# Altium schematic sheet HSS.SchDoc
size A3
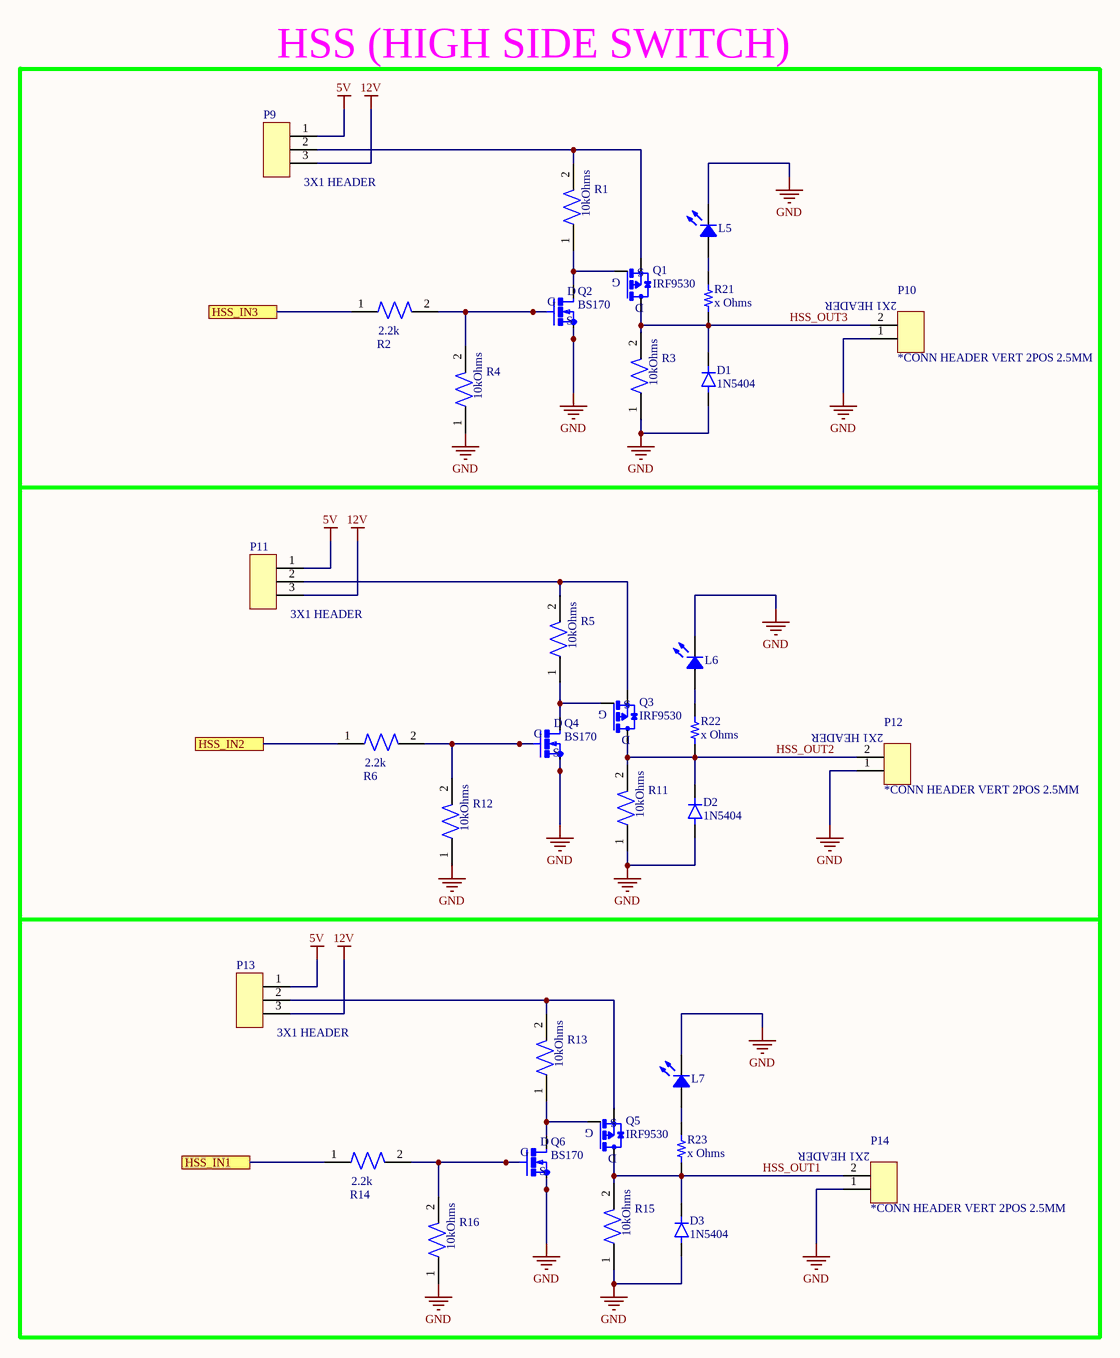
[diagram p0: HSS.SchDoc]

## Parts
D1  1N5404  [DIOAD1990W125L900D530]
D2  1N5404  [DIOAD1990W125L900D530]
D3  1N5404  [DIOAD1990W125L900D530]
L5  LED_SMD  [LED_SMD]  (value not drawn)
L6  LED_SMD  [LED_SMD]  (value not drawn)
L7  LED_SMD  [LED_SMD]  (value not drawn)
P9  CONN HEADER VERT 3POS 2.5MM  [2132230-3]  (value not drawn)
P10  *CONN HEADER VERT 2POS 2.5MM  [51025-02-0100-01]
P11  CONN HEADER VERT 3POS 2.5MM  [2132230-3]  (value not drawn)
P12  *CONN HEADER VERT 2POS 2.5MM  [51025-02-0100-01]
P13  CONN HEADER VERT 3POS 2.5MM  [2132230-3]  (value not drawn)
P14  *CONN HEADER VERT 2POS 2.5MM  [51025-02-0100-01]
Q1  IRF9530  [DPAK508P1524X483-3N]
Q2  BS170  [SOT91P240X120-3N]
Q3  IRF9530  [DPAK508P1524X483-3N]
Q4  BS170  [SOT91P240X120-3N]
Q5  IRF9530  [DPAK508P1524X483-3N]
Q6  BS170  [SOT91P240X120-3N]
R1  RES 10K OHM 1% 1/8W 0805  [RES 1206_3216 RF]  (value not drawn)
R2  RES 10K OHM 1% 1/8W 0805  [RES 0805_2012]  (value not drawn)
R3  RES 10K OHM 1% 1/8W 0805  [RES 1206_3216 RF]  (value not drawn)
R4  RES 10K OHM 1% 1/8W 0805  [RES 1206_3216 RF]  (value not drawn)
R5  RES 10K OHM 1% 1/8W 0805  [RES 1206_3216 RF]  (value not drawn)
R6  RES 10K OHM 1% 1/8W 0805  [RES 0805_2012]  (value not drawn)
R11  RES 10K OHM 1% 1/8W 0805  [RES 1206_3216 RF]  (value not drawn)
R12  RES 10K OHM 1% 1/8W 0805  [RES 1206_3216 RF]  (value not drawn)
R13  RES 10K OHM 1% 1/8W 0805  [RES 1206_3216 RF]  (value not drawn)
R14  RES 10K OHM 1% 1/8W 0805  [RES 0805_2012]  (value not drawn)
R15  RES 10K OHM 1% 1/8W 0805  [RES 1206_3216 RF]  (value not drawn)
R16  RES 10K OHM 1% 1/8W 0805  [RES 1206_3216 RF]  (value not drawn)
R21  x Ohms  [RES 1206_3216 RF]
R22  x Ohms  [RES 1206_3216 RF]
R23  x Ohms  [RES 1206_3216 RF]

## Blocks framed on the sheet
HSS (HIGH SIDE SWITCH): D1-D3 L5-L7 P9-P14 Q1-Q6 R1-R6 R11-R16 R21-R23

## Ports
HSS_IN1, HSS_IN2, HSS_IN3

## Nets
5V: P9.1 P11.1 P13.1
12V: P9.3 P11.3 P13.3
GND: D1.A D2.A D3.A L5.2 L6.2 L7.2 P10.1 P12.1 P14.1 Q2.S Q4.S Q6.S R3.1 R4.1 R11.1 R12.1 R15.1 R16.1
HSS_IN1: R14.1 ; port HSS_IN1
HSS_IN2: R6.1 ; port HSS_IN2
HSS_IN3: R2.1 ; port HSS_IN3
HSS_OUT1: D3.C(K) P14.2 Q5.2(D) R15.2 R23.2
HSS_OUT2: D2.C(K) P12.2 Q3.2(D) R11.2 R22.2
HSS_OUT3: D1.C(K) P10.2 Q1.2(D) R3.2 R21.2
NetL5_1: L5.1 R21.1
NetL6_1: L6.1 R22.1
NetL7_1: L7.1 R23.1
NetP9_2: P9.2 Q1.3(S) R1.2
NetP11_2: P11.2 Q3.3(S) R5.2
NetP13_2: P13.2 Q5.3(S) R13.2
NetQ1_1: Q1.1(G) Q2.D R1.1
NetQ2_G: Q2.G R2.2 R4.2
NetQ3_1: Q3.1(G) Q4.D R5.1
NetQ4_G: Q4.G R6.2 R12.2
NetQ5_1: Q5.1(G) Q6.D R13.1
NetQ6_G: Q6.G R14.2 R16.2

## Notes on the sheet
- (in symbol 2.2k dip) 2.2k
- (in symbol 2132230-3) 3X1 HEADER
- (in symbol B2B-XH-AM(LF)(SN)) 2X1 HEADER
- (in symbol RC0805FR-1310KL) 10kOhms

## Library data of the parts
D1-D3 = 1N5404: Diode Standard 400 V 3A Through Hole DO-201AD; MF: ON Semiconductor; Purchase-URL: https://pricing.snapeda.com/search/part/1N5404/?ref=eda; Price: None; Check_prices: https://www.snapeda.com/parts/1N5404/Onsemi/view-part/?ref=eda; MP: 1N5404; Value: *; Package: AXIAL LEAD-2 ON Semiconductor; SnapEDA_Link: https://www.snapeda.com/parts/1N5404/Onsemi/view-part/?ref=snap; Availability: In Stock
P9 P11 P13 = 2132230-3: Conn Shrouded Header HDR 3Power POS 2.5mm Solder ST Top Entry Thru-Hole Bag; Manufacturer: TE Connectivity; Connector Type: Plug,Header,Pin; Gender: Male; Contact Current Rating: 4.2A; Backwall/Post Interruptions: No (Without); Connector System: Wire-to-Board; Mating Alignment: Yes (With); Voltage Rating: 250V; Current Rating: 3A; Contact Style: Straight; Number of Positions: 3; PCB Mount Retention: Without; PCB Mounting Orientation: Vertical; Plating Thickness: 2.032um; PCB Thickness: 0.063inch; Tail Length: 3.4mm; Supplier 1: Digi-Key; Manufacturer Part Number: 2132230-3; RoHS: Yes; Category: Headers and Wire Housings; Stock 1: 3045; Pricing 1: 1=0,30000, 10=0,25700, 100=0,19970, 500=0,17120, 1000=0,14266, 5000=0,12228, 10000=0,11413 (USD); Mount: Through Hole; Housing Material: Nylon; Housing Color: White; Contact Shape: Square; Contact Material: Brass; Contact Plating: Tin; Color: Natural; Min Operating Temperature: -55°C; Max Operating Temperature: 105°C; Orientation: Straight; Contact Retention: No (Without); Mating Retention: Yes (With); PCB Mount Alignment: Yes (With); Sealable: No (Without); Selectively Loaded: No (Without); Number of Rows: 1; Contact Gender: Male; Package Quantity: 600; Max Voltage Rating (AC): 250V; Packaging: Bag; Termination: Solder; Number of Contacts: 3; Length: 10mm; Width: 6.4mm; Height: 8.8mm; Pitch: 2.5mm; Contact Mating Length: 3.6mm; Depth: 6.4mm; Radiation Hardening: No; ELV: Compliant; Flammability Rating: UL94 V-0; REACH SVHC: No SVHC; Lead Free: Lead Free; ComponentLink1URL: https://datasheet.ciiva.com/12501/ng-cd-2132230-d2-18263-12501858.pdf?src-supplier=Mouser; ComponentLink1Description: https://datasheet.ciiva.com/12501/ng-cd-2132230-d2-18263-12501858.pdf?src-supplier=Mouser; ComponentLink2URL: https://datasheet.ciiva.com/736/eng-cd-2132230-f-736027.pdf?src-supplier=Digi-Key; ComponentLink2Description: https://datasheet.ciiva.com/736/eng-cd-2132230-f-736027.pdf?src-supplier=Digi-Key; ComponentLink3URL: https://datasheet.ciiva.com/30153/790ddetrolleractionsrchrtrvdocnm7-1773461-6ep2-5doctypedatasheetd-30153803.pdf?src-supplier=Onlinecomponents.com; ComponentLink3Description: https://datasheet.ciiva.com/30153/790ddetrolleractionsrchrtrvdocnm7-1773461-6ep2-5doctypedatasheetd-30153803.pdf?src-supplier=Onlinecomponents.com; ComponentLink4URL: https://datasheet.ciiva.com/9528/eng-ds-7-1773461-6ep2-5-0615-9528616.pdf?src-supplier=Avnet; ComponentLink4Description: https://datasheet.ciiva.com/9528/eng-ds-7-1773461-6ep2-5-0615-9528616.pdf?src-supplier=Avnet
P10 P12 P14 = B2B-XH-AM(LF)(SN): Conn Shrouded Header (4 Sides) HDR 2 POS 2.5mm Solder ST Top Entry Thru-Hole Box; Manufacturer: JST; Manufacturer Part Number: B2B-XH-A(LF)(SN); Number of Positions: 2; Connector Type: Male Pin; Contact Resistance: 20mR; Max Current Rating: 3A; Max Voltage Rating (AC): 250V; Insulation Resistance: 1GR; Wire/Cable Gauge: 22AWG; Supplier 1: RSComponents; RoHS: Yes; Category: Headers and Wire Housings; Stock 1: 7000; Mount: Through Hole; Contact Plating: Tin,Copper,Lead; Color: Natural; Contact Material: Brass; Housing Color: White; Housing Material: Polyamide; Min Operating Temperature: -25°C; Max Operating Temperature: 85°C; Number of Rows: 1; Packaging: Bulk; Termination: Solder; Fastening Type: Detent; Current Rating: 3A; Orientation: Straight; Voltage Rating: 250V; Voltage Rating (AC): 250V; Number of Contacts: 2; Max Voltage Rating (DC): 250V; Length: 7.4mm; Pitch: 2.5mm; Depth: 5.75mm; Lead Pitch: 2.5mm; Lead Free: Lead Free; REACH SVHC: No SVHC; ComponentLink1URL: https://datasheet.ciiva.com/26894/getdatasheetpartid-640357-26894434.pdf?src-supplier=Verical; ComponentLink1Description: https://datasheet.ciiva.com/26894/getdatasheetpartid-640357-26894434.pdf?src-supplier=Verical; ComponentLink2URL: https://datasheet.ciiva.com/11746/0900766b8082653e-11746979.pdf?src-supplier=RSComponents; ComponentLink2Description: https://datasheet.ciiva.com/11746/0900766b8082653e-11746979.pdf?src-supplier=RSComponents; ComponentLink3URL: https://datasheet.ciiva.com/26894/getdatasheetpartid-385291-26894760.pdf?src-supplier=Verical; ComponentLink3Description: https://datasheet.ciiva.com/26894/getdatasheetpartid-385291-26894760.pdf?src-supplier=Verical; ComponentLink4URL: https://datasheet.ciiva.com/8052/5448-8052024.pdf?src-supplier=Element14; ComponentLink4Description: https://datasheet.ciiva.com/8052/5448-8052024.pdf?src-supplier=Element14; ComponentLink5URL: https://datasheet.ciiva.com/20207/523653-20207167.pdf?src-supplier=Rapid+Electronics; ComponentLink5Description: https://datasheet.ciiva.com/20207/523653-20207167.pdf?src-supplier=Rapid+Electronics; Supplier 2: Digi-Key; Stock 2: 7636; Pricing 2: 1=0,17000, 10=0,13100, 100=0,09660, 500=0,07998, 1000=0,06999, 5000=0,05999, 10000=0,05832 (USD); ComponentLink6URL: https://datasheet.ciiva.com/26894/getdatasheetpartid-640409-26894436.pdf?src-supplier=Verical; ComponentLink6Description: https://datasheet.ciiva.com/26894/getdatasheetpartid-640409-26894436.pdf?src-supplier=Verical; ComponentLink7URL: https://datasheet.ciiva.com/14800/exh-14800590.pdf?src-supplier=Digi-Key; ComponentLink7Description: https://datasheet.ciiva.com/14800/exh-14800590.pdf?src-supplier=Digi-Key
Q1 Q3 Q5 = IRF9530: P-Channel 100V 14A _Tc_ 79W _Tc_ Through Hole TO-220AB; MF: Vishay; Availability: Unavailable; Price: None; SnapEDA_Link: https://www.snapeda.com/parts/IRF9530/Vishay%20Siliconix/view-part/1770510/?ref=snap; Package: TO-220 Intersil; Value: *; MP: IRF9530
Q2 Q4 Q6 = BS170: N-Channel 60 V 500mA (Ta) 830mW (Ta) Through Hole TO-92-3; MF: ON Semiconductor; SnapEDA_Link: https://www.snapeda.com/parts/BS170/Onsemi/view-part/?ref=snap; Availability: In Stock; Purchase-URL: https://pricing.snapeda.com/search/part/BS170/?ref=eda; MP: BS170; Value: *; Price: None; Package: E-PKG AXIAL-LEADED-2 ON Semiconductor; Check_prices: https://www.snapeda.com/parts/BS170/Onsemi/view-part/?ref=eda
R1 R3-R5 R11-R13 R15 R16 = RC0805FR-1310KL: Res Thick Film 2.0 x 1.2 mm 10K Ohm 1% 0.125W(1/8W) 100ppm/ C Molded SMD Paper T/R; Manufacturer: Yageo; Resistance: 10kR; Power Rating: 125mW; Voltage Rating: 150V; Temperature Coefficient: 100ppm/°C; Supplier 1: Digi-Key; Manufacturer Part Number: RC0805FR-1310KL; RoHS: Yes; Category: Chip SMD Resistors; Stock 1: 79608; Pricing 1: 1=0,10000, 10=0,04200, 100=0,01690, 1000=0,00759, 2500=0,00659, 5000=0,00544 (USD); Case/Package: 0805; Number of Pins: 2; Case Code (Imperial): 0805; Case Code (Metric): 2012; Contact Plating: Tin,Matte,Lead; Min Operating Temperature: -55°C; Max Operating Temperature: 155°C; Tolerance: 1%; Packaging: Tape and Reel; Resistor Type: Thick Film; Termination: SMD/SMT; Voltage Rating (DC): 150V; Series: RC; Resistance Tolerance: 1%; Radiation Hardening: No; REACH SVHC: No SVHC; Lead Free: Lead Free; RoHS Compliant: Yes; ComponentLink1URL: http://www.mouser.com/ds/2/447/Yageo_08112016_RC0805-968729.pdf?src-supplier=Mouser; ComponentLink1Description: http://www.mouser.com/ds/2/447/Yageo_08112016_RC0805-968729.pdf?src-supplier=Mouser; ComponentLink2URL: http://components.arrow.com/part/dataview/0323_00200993?src-supplier=Arrow+Europe; ComponentLink2Description: http://components.arrow.com/part/dataview/0323_00200993?src-supplier=Arrow+Europe; ComponentLink3URL: http://www.farnell.com/datasheets/2167052.pdf?src-supplier=Farnell; ComponentLink3Description: http://www.farnell.com/datasheets/2167052.pdf?src-supplier=Farnell; ComponentLink4URL: http://www.farnell.com/datasheets/2167052.pdf?src-supplier=Element14; ComponentLink4Description: http://www.farnell.com/datasheets/2167052.pdf?src-supplier=Element14; ComponentLink5URL: http://www.farnell.com/datasheets/2167052.pdf?src-supplier=Newark; ComponentLink5Description: http://www.farnell.com/datasheets/2167052.pdf?src-supplier=Newark; ComponentLink6URL: http://www.yageo.com/pdf/PYu-RC0805_51_RoHS_L_4.pdf?src-supplier=Avnet; ComponentLink6Description: http://www.yageo.com/pdf/PYu-RC0805_51_RoHS_L_4.pdf?src-supplier=Avnet; ComponentLink7URL: http://www.yageo.com/documents/recent/PYu-RC0805_51_RoHS_L_5.pdf?src-supplier=Avnet+Europe; ComponentLink7Description: http://www.yageo.com/documents/recent/PYu-RC0805_51_RoHS_L_5.pdf?src-supplier=Avnet+Europe; Supplier Part Number 1: 13-RC0805FR-1310KLCT-ND
R2 R6 R14 = 2.2k dip: Manufacturer: Vishay; Manufacturer Part Number: CRCW06032K20FKEAHP; Resistance: 2.2kR; Temperature Coefficient: 100ppm/°C; Power Rating: 250mW; Voltage Rating: 75V; RoHS: Yes; Category: Chip SMD Resistors; Stock 1: 19777; Pricing 1: 1=0,17000, 10=0,14800, 100=0,05790, 1000=0,02422, 2500=0,02220 (USD); Mount: Surface Mount; Case/Package: 0603; Contact Plating: Tin; Case Code (Metric): 1608; Case Code (Imperial): 0603; Min Operating Temperature: -55°C; Max Operating Temperature: 155°C; Tolerance: 1%; Resistor Type: Thick Film; Packaging: Tape and Reel; Package Quantity: 1; Number of Terminations: 2; Termination: Solder; Max Power Dissipation: 250mW; Voltage Rating (DC): 75V; Features: Automotive AEC-Q200; Series: CRCW-HP; Construction: Rectangular; Technology: THICK FILM; Resistance Tolerance: 1%; Length: 1.6mm; Width: 0.033inch; Height: 0.02inch; Depth: 0.85mm; Radiation Hardening: No; REACH SVHC: Unknown; Military Standard: Not; Lead Free: Lead Free; RoHS Compliant: Yes
R21-R23 = RT1206BRD0749R9L: RES SMD 49.9 OHM 0.1% 1/4W 1206; Manufacturer: Yageo; Power (Watts): 0.25W, 1/4W; Resistance: 49.9 Ohms; Temperature Coefficient: ±25ppm/°C; Value: 49.9 Ohms; Part Number: RT1206BRD0749R9L; ComponentLink1Description: Datasheet; ComponentLink1URL: https://www.yageo.com/upload/media/product/productsearch/datasheet/rchip/PYu-RT_1-to-0.01_RoHS_L_11.pdf; ComponentLink2Description: DigiKey Link; ComponentLink2URL: https://www.digikey.com/en/products/detail/yageo/RT1206BRD0749R9L/1079849; Composition: Thin Film; Device Package: 1206 (3216 Metric); Height - Seated (Max): 0.026" (0.65mm); LastUpdated: 4.08.2022 05:00:43; Lifecycle Status: Active; Minimum Order: 1; Number of Terminations: 2; Operating Temperature: -55°C ~ 155°C; Package / Case: 1206 (3216 Metric); Packaging: TapeAndReel; PartId: 26863; Part Status: Active; Price: 0.10; Series: RT; Size / Dimension: 0.122" L x 0.063" W (3.10mm x 1.60mm); Supplier 1: DigiKey; Supplier Part Number 1: YAG5080CT-ND; Supplier Device Package: 1206; Tolerance: ±0.1%